# EAGLE design Blueberry Pi (EAGLE 7.3.0)
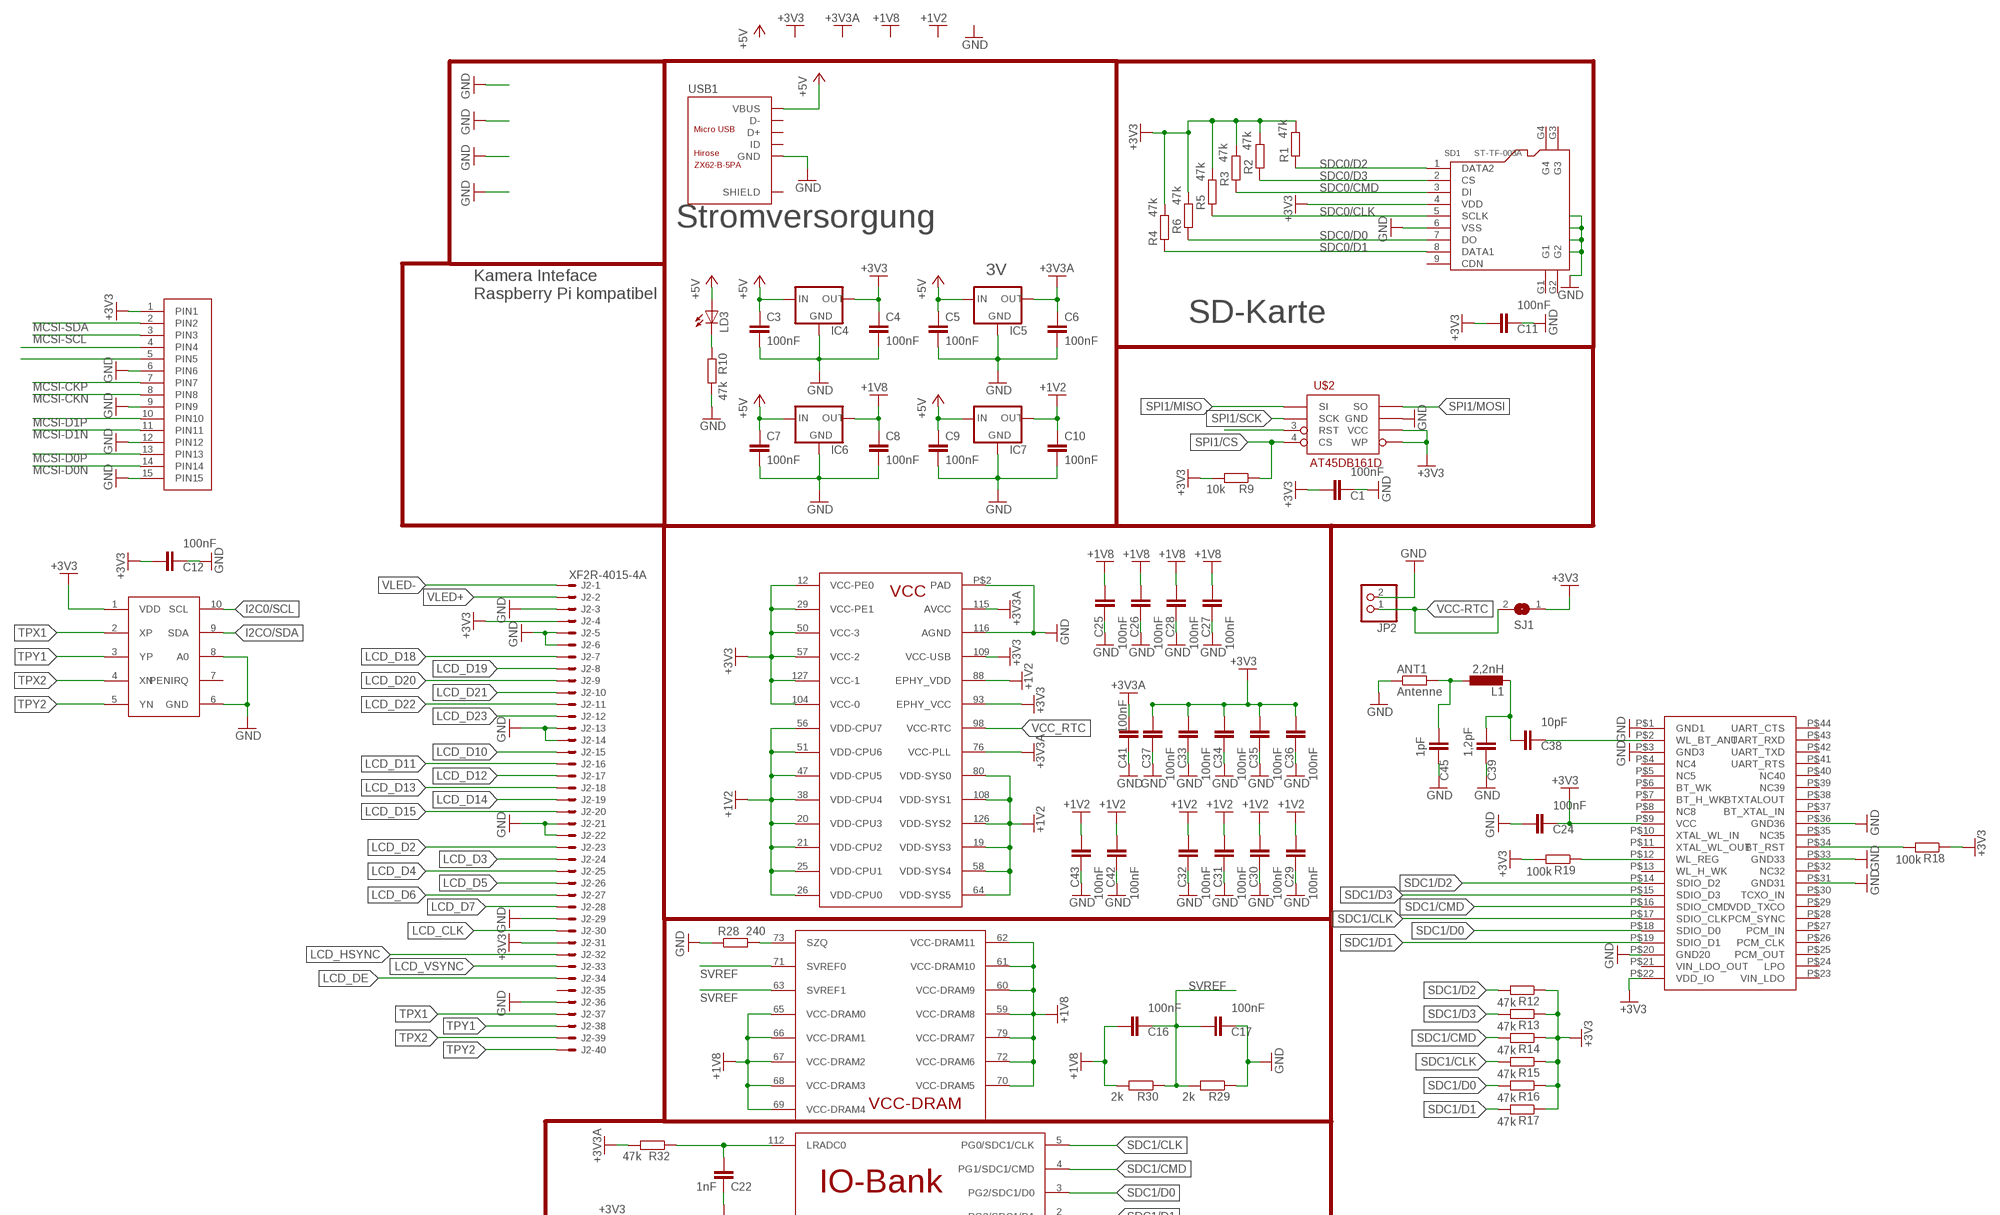
[diagram p0: schematic, sheet 1, part 1 of 2]
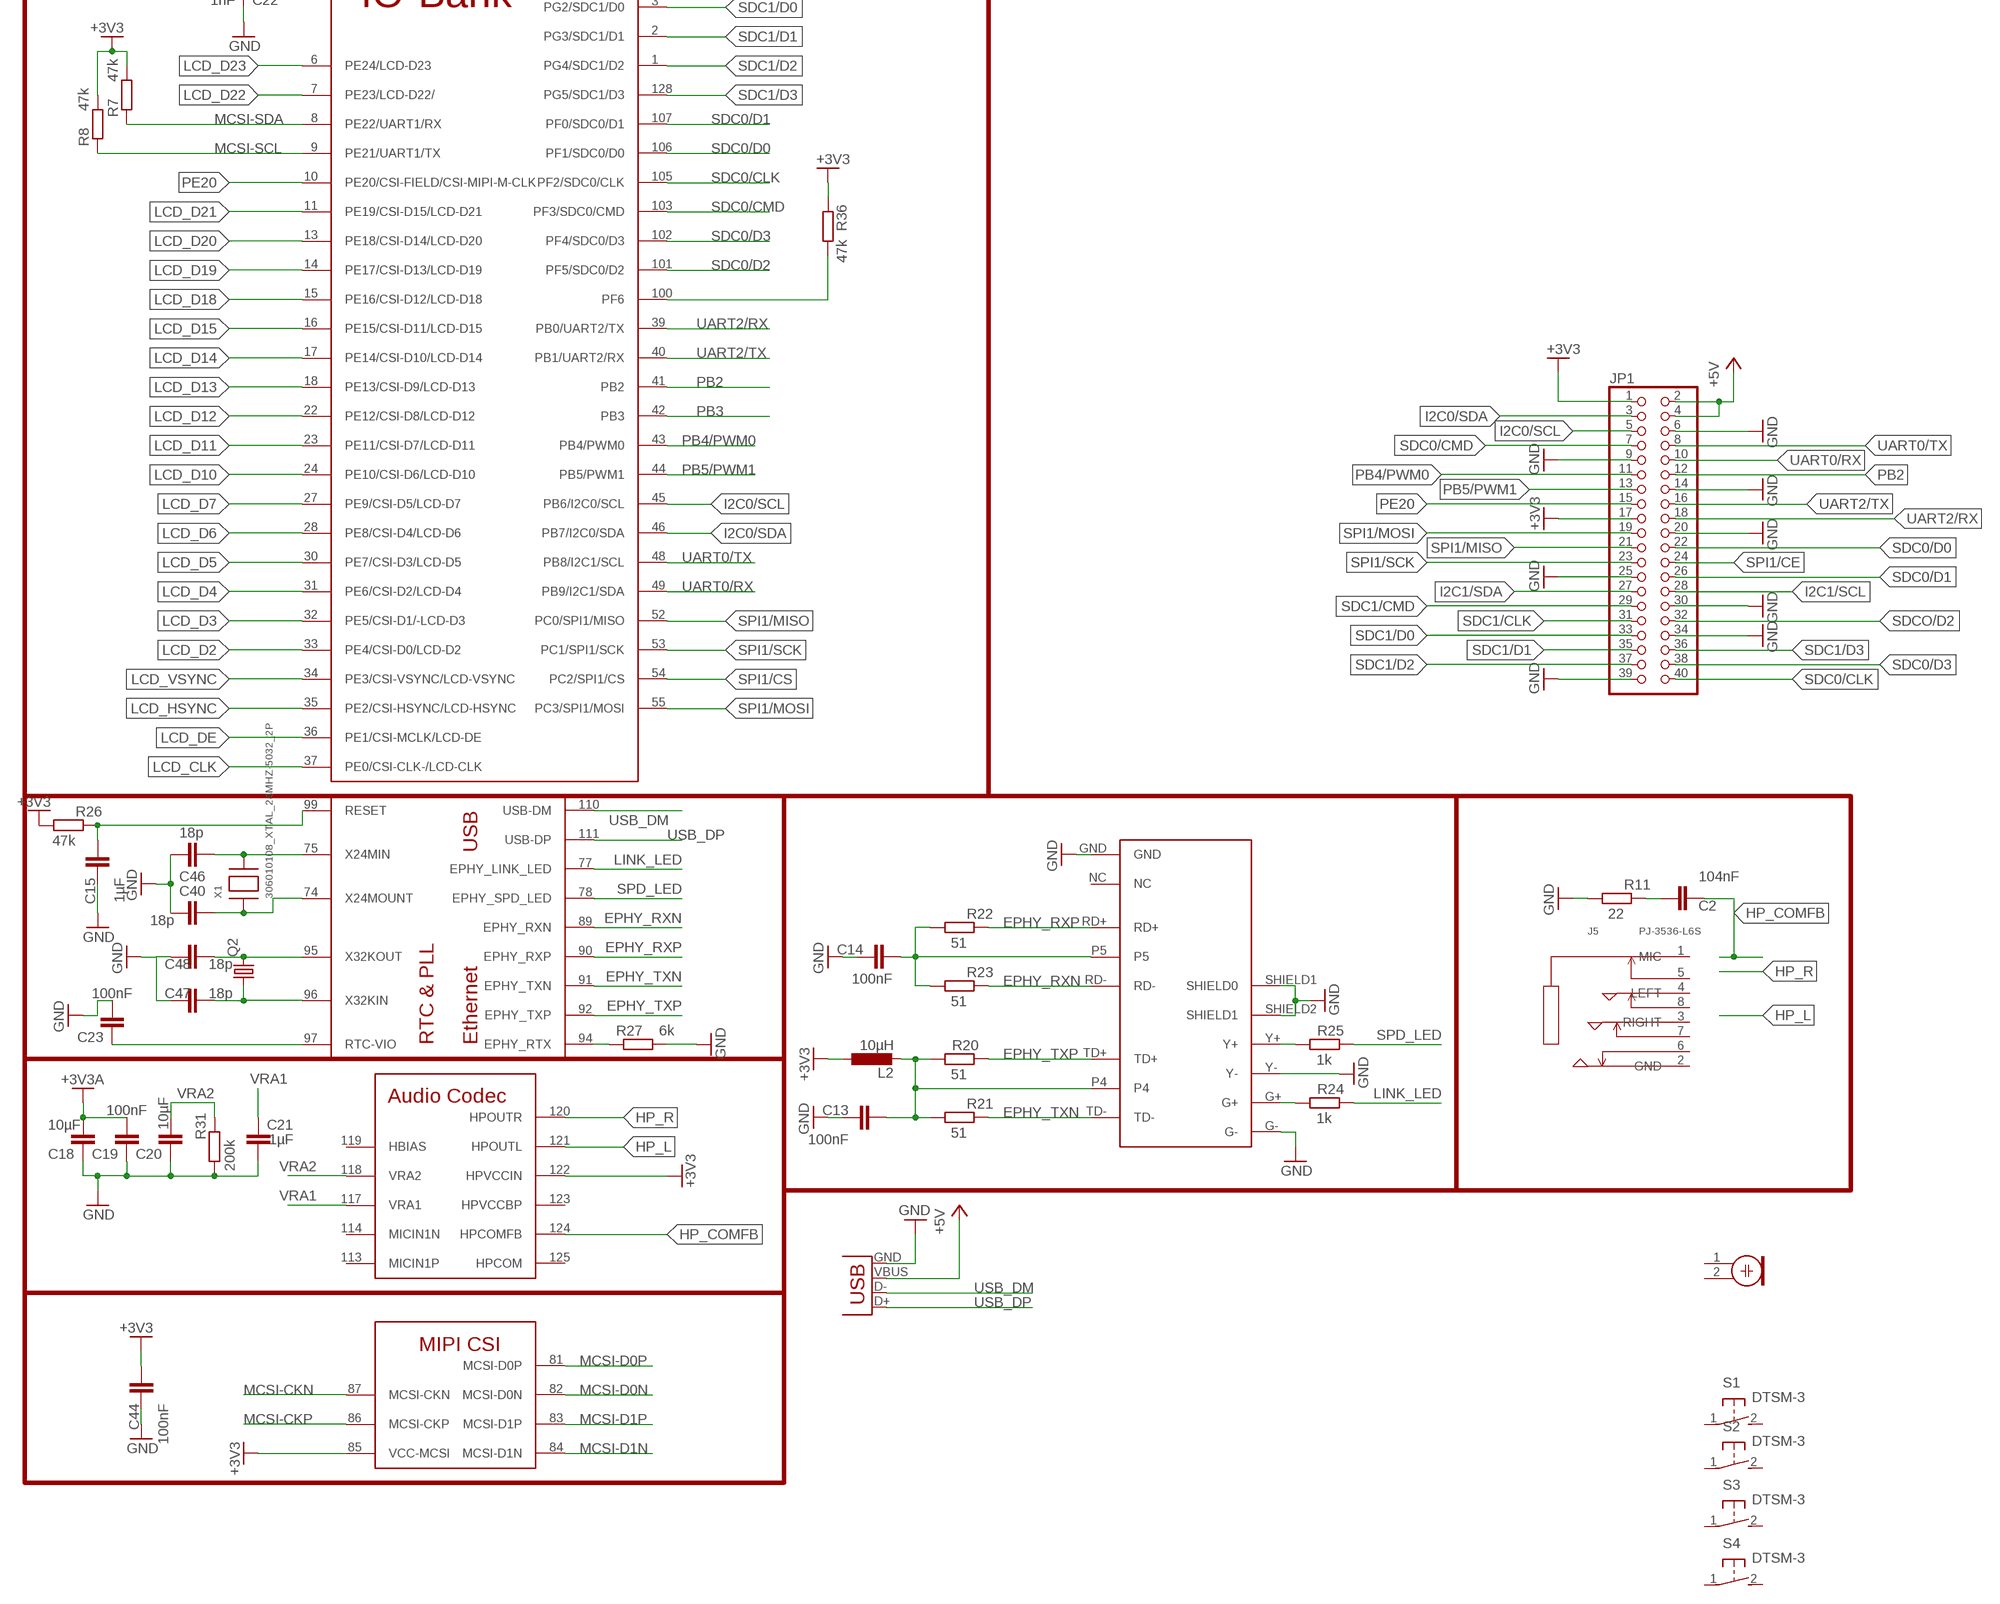
[diagram p1: schematic, sheet 1, part 2 of 2]

## Parts
ANT1  Antenne  R-EU_R0603  [R0603]
C1  100nF  C-EUC0603  [C0603]
C2  104nF  C-EUC0603  [C0603]
C3  100nF  C-EUC0603  [C0603]
C4  100nF  C-EUC0603  [C0603]
C5  100nF  C-EUC0603  [C0603]
C6  100nF  C-EUC0603  [C0603]
C7  100nF  C-EUC0603  [C0603]
C8  100nF  C-EUC0603  [C0603]
C9  100nF  C-EUC0603  [C0603]
C10  100nF  C-EUC0603  [C0603]
C11  100nF  C-EUC0603  [C0603]
C12  100nF  C-EUC0603  [C0603]
C13  100nF  C-EUC0603  [C0603]
C14  100nF  C-EUC0603  [C0603]
C15  1µF  C-EUC0603  [C0603]
C16  100nF  C-EUC0603  [C0603]
C17  100nF  C-EUC0603  [C0603]
C18  10µF  C-EUC0603  [C0603]
C19  100nF  C-EUC0603  [C0603]
C20  10µF  C-EUC0603  [C0603]
C21  1µF  C-EUC0603  [C0603]
C22  1nF  C-EUC0603  [C0603]
C23  100nF  C-EUC0603  [C0603]
C24  100nF  C-EUC0603  [C0603]
C25  100nF  C-EUC0603  [C0603]
C26  100nF  C-EUC0603  [C0603]
C27  100nF  C-EUC0603  [C0603]
C28  100nF  C-EUC0603  [C0603]
C29  100nF  C-EUC0603  [C0603]
C30  100nF  C-EUC0603  [C0603]
C31  100nF  C-EUC0603  [C0603]
C32  100nF  C-EUC0603  [C0603]
C33  100nF  C-EUC0603  [C0603]
C34  100nF  C-EUC0603  [C0603]
C35  100nF  C-EUC0603  [C0603]
C36  100nF  C-EUC0603  [C0603]
C37  100nF  C-EUC0603  [C0603]
C38  10pF  C-EUC0603  [C0603]
C39  1,2pF  C-EUC0603  [C0603]
C40  18p  C-EUC0603  [C0603]
C41  100nF  C-EUC0603  [C0603]
C42  100nF  C-EUC0603  [C0603]
C43  100nF  C-EUC0603  [C0603]
C44  100nF  C-EUC0603  [C0603]
C45  1pF  C-EUC0603  [C0603]
C46  18p  C-EUC0603  [C0603]
C47  18p  C-EUC0603  [C0603]
C48  18p  C-EUC0603  [C0603]
IC1  V3S  [QFP-128]
IC4  LM1117  [SOT223]
IC5  LM1117  [SOT223]
IC6  LM1117  [SOT223]
IC7  LM1117  [SOT223]
J2  XF2R-4015-4A  [XF2R-4015-4A]
J5  PJ-3536-L6S  AUDIO-JACK-SMD-8P(PJ-3536-L6S)  [AUDIO8P-SMD-3.5-14.5X6X5MM]
JP1  PINHD-2X20  [2X20]
JP2  PINHD-1X2  [1X02]
L1  2,2nH  L-EUL0805  [L0805]
L2  10µH  L-EUL0805  [L0805]
LD3  LEDSMT1206  [1206]
M1  ELECTRET_MICROPHON-F6035AP  [F6035AP]
Q2  CRYSTALTC26H  [TC26H]
R1  47k  R-EU_R0603  [R0603]
R2  47k  R-EU_R0603  [R0603]
R3  47k  R-EU_R0603  [R0603]
R4  47k  R-EU_R0603  [R0603]
R5  47k  R-EU_R0603  [R0603]
R6  47k  R-EU_R0603  [R0603]
R7  47k  R-EU_R0603  [R0603]
R8  47k  R-EU_R0603  [R0603]
R9  10k  R-EU_R0603  [R0603]
R10  47k  R-EU_R0603  [R0603]
R11  22  R-EU_R0603  [R0603]
R12  47k  R-EU_R0603  [R0603]
R13  47k  R-EU_R0603  [R0603]
R14  47k  R-EU_R0603  [R0603]
R15  47k  R-EU_R0603  [R0603]
R16  47k  R-EU_R0603  [R0603]
R17  47k  R-EU_R0603  [R0603]
R18  100k  R-EU_R0603  [R0603]
R19  100k  R-EU_R0603  [R0603]
R20  51  R-EU_R0603  [R0603]
R21  51  R-EU_R0603  [R0603]
R22  51  R-EU_R0603  [R0603]
R23  51  R-EU_R0603  [R0603]
R24  1k  R-EU_R0603  [R0603]
R25  1k  R-EU_R0603  [R0603]
R26  47k  R-EU_R0603  [R0603]
R27  6k  R-EU_R0603  [R0603]
R28  240  R-EU_R0603  [R0603]
R29  2k  R-EU_R0603  [R0603]
R30  2k  R-EU_R0603  [R0603]
R31  200k  R-EU_R0603  [R0603]
R32  47k  R-EU_R0603  [R0603]
R36  47k  R-EU_R0603  [R0603]
S1  DTSM-3  [DTSM-3]
S2  DTSM-3  [DTSM-3]
S3  DTSM-3  [DTSM-3]
S4  DTSM-3  [DTSM-3]
SD1  ST-TF-003A  MICRO-SD-CARD-SOCKET-9P(ST-TF-003A)  [MICRO-SD9+4P-SMD-16.1X14.5X1.85MM]
SJ1  SJ  [SJ]
U$1  NS2009  [MSOP10]
U$2  AT45DB161D  [SO08-EIAJ]
U$3  HR911105A  [RJ45]
U$4  RTL8723BS  [LGA]
U$5  52610-1533  [MOLEX_52610-1533]
USB1  ZX62-B-5PA  MICRO-USB-SMD(ZX62-B-5PA)  [MICRO-USB5+6P-SMD-0.65-AB]
X1  306010108_XTAL_24MHZ-5032_2P  [X5032_2P]
X2  USB-A-H  [USB-A-H]

## Nets
+1V2: C10.1 C29.1 C30.1 C31.1 C32.1 C42.1 C43.1 IC1.19(VDD-SYS3) IC1.20(VDD-CPU3) IC1.21(VDD-CPU2) IC1.25(VDD-CPU1) IC1.26(VDD-CPU0) IC1.38(VDD-CPU4) IC1.47(VDD-CPU5) IC1.51(VDD-CPU6) IC1.56(VDD-CPU7) IC1.58(VDD-SYS4) IC1.64(VDD-SYS5) IC1.80(VDD-SYS0) IC1.88(EPHY_VDD) IC1.108(VDD-SYS1) IC1.126(VDD-SYS2) IC7.2(OUT)
+1V8: C8.1 C16.1 C25.1 C26.1 C27.1 C28.1 IC1.59(VCC-DRAM8) IC1.60(VCC-DRAM9) IC1.61(VCC-DRAM10) IC1.62(VCC-DRAM11) IC1.65(VCC-DRAM0) IC1.66(VCC-DRAM1) IC1.67(VCC-DRAM2) IC1.68(VCC-DRAM3) IC1.69(VCC-DRAM4) IC1.70(VCC-DRAM5) IC1.72(VCC-DRAM6) IC1.79(VCC-DRAM7) IC6.2(OUT) R30.2
+3V3: C1.1 C4.1 C11.1 C12.1 C24.2 C33.1 C34.1 C35.1 C36.1 C37.1 C44.1 IC1.12(VCC-PE0) IC1.29(VCC-PE1) IC1.50(VCC-3) IC1.57(VCC-2) IC1.85(VCC-MCSI) IC1.93(EPHY_VCC) IC1.104(VCC-0) IC1.109(VCC-USB) IC1.122(HPVCCIN) IC1.127(VCC-1) IC4.2(OUT) J2.4 J2.31 JP1.1 JP1.17 L2.1 R1.2 R2.2 R3.2 R4.2 R5.2 R6.2 R7.2 R8.2 R9.2 R12.1 R13.1 R14.1 R15.1 R16.1 R17.1 R18.1 R19.2 R26.2 R36.1 SD1.4(VDD) SJ1.1 U$1.1(VDD) U$2.5(WP) U$2.6(VCC) U$4.P$9(VCC) U$4.P$22(VDD_IO) U$5.1(PIN1)
+3V3A: C6.1 C18.1 C19.1 C41.1 IC1.76(VCC-PLL) IC1.115(AVCC) IC5.2(OUT) R32.2
+5V: C3.1 C5.1 C7.1 C9.1 IC4.3(IN) IC5.3(IN) IC6.3(IN) IC7.3(IN) JP1.2 JP1.4 LD3.A X2.VBUS
EPHY_RXN: IC1.89(EPHY_RXN) R23.1 U$3.RD-
EPHY_RXP: IC1.90(EPHY_RXP) R22.1 U$3.RD+
EPHY_TXN: IC1.91(EPHY_TXN) R21.1 U$3.TD-
EPHY_TXP: IC1.92(EPHY_TXP) R20.1 U$3.TD+
GND: ANT1.1 C1.2 C3.2 C4.2 C5.2 C6.2 C7.2 C8.2 C9.2 C10.2 C11.2 C12.2 C13.2 C14.2 C15.2 C17.2 C18.2 C19.2 C20.2 C21.2 C22.1 C23.1 C24.1 C25.2 C26.2 C27.2 C28.2 C29.2 C30.2 C31.2 C32.2 C33.2 C34.2 C35.2 C36.2 C37.2 C39.1 C40.1 C41.2 C42.2 C43.2 C44.2 C45.1 C46.1 C47.1 C48.1 IC1.116(AGND) IC1.P$2(PAD) IC4.1(GND) IC5.1(GND) IC6.1(GND) IC7.1(GND) J2.3 J2.5 J2.6 J2.13 J2.14 J2.21 J2.22 J2.29 J2.36 JP1.6 JP1.9 JP1.14 JP1.20 JP1.25 JP1.30 JP1.34 JP1.39 JP2.2 R10.2 R11.2 R27.2 R28.1 R29.1 R31.2 SD1.6(VSS) U$1.6(GND) U$1.8(A0) U$2.7(GND) U$3.G- U$3.GND U$3.SHIELD1(SHIELD0) U$3.SHIELD2(SHIELD1) U$3.Y- U$4.P$1(GND1) U$4.P$3(GND3) U$4.P$20(GND20) U$4.P$31(GND31) U$4.P$33(GND33) U$4.P$36(GND36) U$5.6(PIN6) U$5.9(PIN9) U$5.12(PIN12) U$5.15(PIN15) USB1.5(GND) X2.GND
HP_COMFB: C2.2 IC1.124(HPCOMFB)
HP_L: IC1.121(HPOUTL)
HP_R: IC1.120(HPOUTR)
I2C0/SCL: IC1.45(PB6/I2C0/SCL) JP1.5 U$1.10(SCL)
I2C0/SDA: IC1.46(PB7/I2C0/SDA) JP1.3
I2C1/SCL: JP1.28
I2C1/SDA: JP1.27
I2CO/SDA: U$1.9(SDA)
LCD_CLK: IC1.37(PE0/CSI-CLK-/LCD-CLK) J2.30
LCD_D2: IC1.33(PE4/CSI-D0/LCD-D2) J2.23
LCD_D3: IC1.32(PE5/CSI-D1/-LCD-D3) J2.24
LCD_D4: IC1.31(PE6/CSI-D2/LCD-D4) J2.25
LCD_D5: IC1.30(PE7/CSI-D3/LCD-D5) J2.26
LCD_D6: IC1.28(PE8/CSI-D4/LCD-D6) J2.27
LCD_D7: IC1.27(PE9/CSI-D5/LCD-D7) J2.28
LCD_D10: IC1.24(PE10/CSI-D6/LCD-D10) J2.15
LCD_D11: IC1.23(PE11/CSI-D7/LCD-D11) J2.16
LCD_D12: IC1.22(PE12/CSI-D8/LCD-D12) J2.17
LCD_D13: IC1.18(PE13/CSI-D9/LCD-D13) J2.18
LCD_D14: IC1.17(PE14/CSI-D10/LCD-D14) J2.19
LCD_D15: IC1.16(PE15/CSI-D11/LCD-D15) J2.20
LCD_D18: IC1.15(PE16/CSI-D12/LCD-D18) J2.7
LCD_D19: IC1.14(PE17/CSI-D13/LCD-D19) J2.8
LCD_D20: IC1.13(PE18/CSI-D14/LCD-D20) J2.9
LCD_D21: IC1.11(PE19/CSI-D15/LCD-D21) J2.10
LCD_D22: IC1.7(PE23/LCD-D22/) J2.11
LCD_D23: IC1.6(PE24/LCD-D23) J2.12
LCD_DE: IC1.36(PE1/CSI-MCLK/LCD-DE) J2.34
LCD_HSYNC: IC1.35(PE2/CSI-HSYNC/LCD-HSYNC) J2.32
LCD_VSYNC: IC1.34(PE3/CSI-VSYNC/LCD-VSYNC) J2.33
LINK_LED: IC1.77(EPHY_LINK_LED) R24.1
MCSI-CKN: IC1.87(MCSI-CKN) U$5.8(PIN8)
MCSI-CKP: IC1.86(MCSI-CKP) U$5.7(PIN7)
MCSI-D0N: IC1.82(MCSI-D0N) U$5.14(PIN14)
MCSI-D0P: IC1.81(MCSI-D0P) U$5.13(PIN13)
MCSI-D1N: IC1.84(MCSI-D1N) U$5.11(PIN11)
MCSI-D1P: IC1.83(MCSI-D1P) U$5.10(PIN10)
MCSI-SCL: IC1.9(PE21/UART1/TX) R8.1 U$5.3(PIN3)
MCSI-SDA: IC1.8(PE22/UART1/RX) R7.1 U$5.2(PIN2)
N$2: R18.2 U$4.P$34(BT_RST)
N$3: C2.1 R11.1
N$4: C15.1 IC1.99(RESET) R26.1
N$5: U$2.3(RST)
N$6: LD3.C R10.1
N$7: R19.1 U$4.P$12(WL_REG)
N$8: U$5.5(PIN5)
N$9: U$5.4(PIN4)
N$10: C38.2 U$4.P$2(WL_BT_ANT)
N$11: C38.1 C39.2 L1.2
N$12: ANT1.2 C45.2 L1.1
N$17: IC1.94(EPHY_RTX) R27.1
N$18: R24.2 U$3.G+
N$19: IC1.73(SZQ) R28.2
N$20: R25.2 U$3.Y+
N$21: C13.1 L2.2 R20.2 R21.2 U$3.P4
N$22: C14.1 R22.2 R23.2 U$3.P5
N$23: C22.2 IC1.112(LRADC0) R32.1
N$24: C23.2 IC1.97(RTC-VIO)
N$25: IC1.100(PF6) R36.2
N$46: C40.2 IC1.74(X24MOUNT) X1.P$1
N$47: C46.2 IC1.75(X24MIN) X1.P$2
N$48: C47.2 IC1.96(X32KIN) Q2.1
N$49: C48.2 IC1.95(X32KOUT) Q2.2
PB2: IC1.41(PB2) JP1.12
PB3: IC1.42(PB3)
PB4/PWM0: IC1.43(PB4/PWM0) JP1.11
PB5/PWM1: IC1.44(PB5/PWM1) JP1.13
PE20: IC1.10(PE20/CSI-FIELD/CSI-MIPI-M-CLK) JP1.15
SDC0/CLK: IC1.105(PF2/SDC0/CLK) JP1.40 R5.1 SD1.5(SCLK)
SDC0/CMD: IC1.103(PF3/SDC0/CMD) JP1.7 R3.1 SD1.3(DI)
SDC0/D0: IC1.106(PF1/SDC0/D0) JP1.22 R6.1 SD1.7(DO)
SDC0/D1: IC1.107(PF0/SDC0/D1) JP1.26 R4.1 SD1.8(DATA1)
SDC0/D2: IC1.101(PF5/SDC0/D2) R1.1 SD1.1(DATA2)
SDC0/D3: IC1.102(PF4/SDC0/D3) JP1.38 R2.1 SD1.2(CS)
SDC1/CLK: IC1.5(PG0/SDC1/CLK) JP1.31 R15.2 U$4.P$17(SDIO_CLK)
SDC1/CMD: IC1.4(PG1/SDC1/CMD) JP1.29 R14.2 U$4.P$16(SDIO_CMD)
SDC1/D0: IC1.3(PG2/SDC1/D0) JP1.33 R16.2 U$4.P$18(SDIO_D0)
SDC1/D1: IC1.2(PG3/SDC1/D1) JP1.35 R17.2 U$4.P$19(SDIO_D1)
SDC1/D2: IC1.1(PG4/SDC1/D2) JP1.37 R12.2 U$4.P$14(SDIO_D2)
SDC1/D3: IC1.128(PG5/SDC1/D3) JP1.36 R13.2 U$4.P$15(SDIO_D3)
SDCO/D2: JP1.32
SPD_LED: IC1.78(EPHY_SPD_LED) R25.1
SPI1/CE: JP1.24
SPI1/CS: IC1.54(PC2/SPI1/CS) R9.1 U$2.4(CS)
SPI1/MISO: IC1.52(PC0/SPI1/MISO) JP1.21 U$2.1(SI)
SPI1/MOSI: IC1.55(PC3/SPI1/MOSI) JP1.19 U$2.8(SO)
SPI1/SCK: IC1.53(PC1/SPI1/SCK) JP1.23 U$2.2(SCK)
SVREF: C16.2 C17.1 IC1.63(SVREF1) IC1.71(SVREF0) R29.2 R30.1
TPX1: J2.37 U$1.2(XP)
TPX2: J2.39 U$1.4(XN)
TPY1: J2.38 U$1.3(YP)
TPY2: J2.40 U$1.5(YN)
UART0/RX: IC1.49(PB9/I2C1/SDA) JP1.10
UART0/TX: IC1.48(PB8/I2C1/SCL) JP1.8
UART2/RX: IC1.39(PB0/UART2/TX) JP1.18
UART2/TX: IC1.40(PB1/UART2/RX) JP1.16
USB_DM: IC1.110(USB-DM) X2.D-
USB_DP: IC1.111(USB-DP) X2.D+
VBUS: USB1.1(VBUS) ; supply symbol labelled +5V
VCC-RTC: JP2.1 SJ1.2
VCC_RTC: IC1.98(VCC-RTC)
VLED+: J2.2
VLED-: J2.1
VRA1: C21.1 IC1.117(VRA1)
VRA2: C20.1 IC1.118(VRA2) R31.1
Unconnected: IC1.113(MICIN1P) IC1.114(MICIN1N) IC1.119(HBIAS) IC1.123(HPVCCBP) IC1.125(HPCOM) J2.35 J5.1(MIC) J5.2(GND) J5.3(RIGHT) J5.4(LEFT) J5.5 J5.6 J5.7 J5.8 M1.1 M1.2 S1.1 S1.2 S2.1 S2.2 S3.1 S3.2 S4.1 S4.2 SD1.9(CDN) SD1.G1 SD1.G2 SD1.G3 SD1.G4 U$1.7(PENIRQ) U$3.NC U$4.P$4(NC4) U$4.P$5(NC5) U$4.P$6(BT_WK) U$4.P$7(BT_H_WK) U$4.P$8(NC8) U$4.P$10(XTAL_WL_IN) U$4.P$11(XTAL_WL_OUT) U$4.P$13(WL_H_WK) U$4.P$21(VIN_LDO_OUT) U$4.P$23(VIN_LDO) U$4.P$24(LPO) U$4.P$25(PCM_OUT) U$4.P$26(PCM_CLK) U$4.P$27(PCM_IN) U$4.P$28(PCM_SYNC) U$4.P$29(VDD_TXCO) U$4.P$30(TCXO_IN) U$4.P$32(NC32) U$4.P$35(NC35) U$4.P$37(BT_XTAL_IN) U$4.P$38(BTXTALOUT) U$4.P$39(NC39) U$4.P$40(NC40) U$4.P$41(UART_RTS) U$4.P$42(UART_TXD) U$4.P$43(UART_RXD) U$4.P$44(UART_CTS) USB1.2(D-) USB1.3(D+) USB1.4(ID) USB1.P1(SHIELD) USB1.P2(SHIELD) USB1.P3(SHIELD) USB1.P4(SHIELD) USB1.P5(SHIELD) USB1.P6(SHIELD)

## Notes on the sheet
- Stromversorgung
- 3V
- Kamera Inteface 
  Raspberry Pi kompatibel
- SD-Karte

## Library data of the parts
ANT1 R1-R32 R36 = rcl:R-EU_: RESISTOR, European symbol
C1-C48 = rcl:C-EU: CAPACITOR, European symbol
IC1 = Allwinner V3s:V3S
IC4-IC7 = v-reg-2:LM1117
J2 = con-omron:XF2*-40?: OMRON FPC Connector Source : http://www.omron.com/ecb/products/pdf/fpc.pdf
J5 = Seeed-Connector:AUDIO-JACK-SMD-8P(PJ-3536-L6S): 320040003; MPN: PJ-3536-L6S
JP1 = pinhead:PINHD-2X20: PIN HEADER
JP2 = pinhead:PINHD-1X2: PIN HEADER
L1 L2 = rcl:L-EU: INDUCTOR, European symbol
LD3 = led:LED: LED OSRAM: - CHIPLED LG R971, LG N971, LY N971, LG Q971, LY Q971, LO R971, LY R971 LH N974, LH R974 LS Q976, LO Q976, LY Q976 LO Q996 - Hyper CHIPLED LW Q18S LB Q993, LB Q99A, LB R99A - SideLED LS A670, LO A670, LY A670, LG A670, LP A670 LB A673, LV A673, LT A673, LW A673 LH A674 LY A675 LS A676, LA A676, LO A676, LY A676, LW A676 LS A679, LY A679, LG A679 - Hyper Micro SIDELED® LS Y876, LA Y876, LO Y876, LY Y876 LT Y87S - SmartLED LW L88C, LW L88S LB L89C, LB L89S, LG L890 LS L89K, LO L89K, LY L89K LS L896, LA L896, LO L896, LY L896 - TOPLED LS T670, LO T670, LY T670, LG T670, LP T670 LSG T670, LSP T670, LSY T670, LOP T670, LYG T670 LG T671, LOG T671, LSG T671 LB T673, LV T673, LT T673, LW T673 LH T674 LS T676, LA T676, LO T676, LY T676, LB T676, LH T676, LSB T676, LW T676 LB T67C, LV T67C, LT T67C, LS T67K, LO T67K, LY T67K, LW E67C LS E67B, LA E67B, LO E67B, LY E67B, LB E67C, LV E67C, LT E67C LW T67C LS T679, LY T679, LG T679 LS T770, LO T770, LY T770, LG T770, LP T770 LB T773, LV T773, LT T773, LW T773 LH T774 LS E675, LA E675, LY E675, LS T675 LS T776, LA T776, LO T776, LY T776, LB T776 LHGB T686 LT T68C, LB T68C - Hyper Mini TOPLED® LB M676 - Mini TOPLED Santana® LG M470 LS M47K, LO M47K, LY M47K Source: http://www.osram.convergy.de/
M1 = microphon:ELECTRET_MICROPHON-: Electret Condenser Microphone
Q2 = crystal:CRYSTAL: CRYSTAL; OC_FARNELL: unknown; OC_NEWARK: unknown
S1-S4 = switch-tact:DTSM-3
SD1 = Seeed-Connector:MICRO-SD-CARD-SOCKET-9P(ST-TF-003A): 320090000; MPN: ST-TF-003A
SJ1 = jumper:SJ: SMD solder JUMPER
U$1 = NS2009:NS2009
U$2 = SparkFun-Retired:AT45DB161D: 16-Mbit SPI flash memory Retired IC-08556
U$3 = HR911105A:HR911105A
U$4 = RTL8723BS_Modul:RTL8723BS
U$5 = Molex_By_element14_Batch_1:52610-1533
USB1 = Seeed-Connector:MICRO-USB-SMD(ZX62-B-5PA): 320010005; MPN: ZX62-B-5PA
X1 = Seeed-OPL-2017-01-Crystal-Akita:306010108_XTAL_24MHZ-5032_2P: TXC CORPORATION;7A-24.000MAAJ-T, SMD Crystal;24MHz-18pF-30ppm-2P-5*3.2*1.35, SKU: 306010108
X2 = con-usb:USB: USB Connectors

## Net classes
0 default: clearance 0.152 mm

## Board
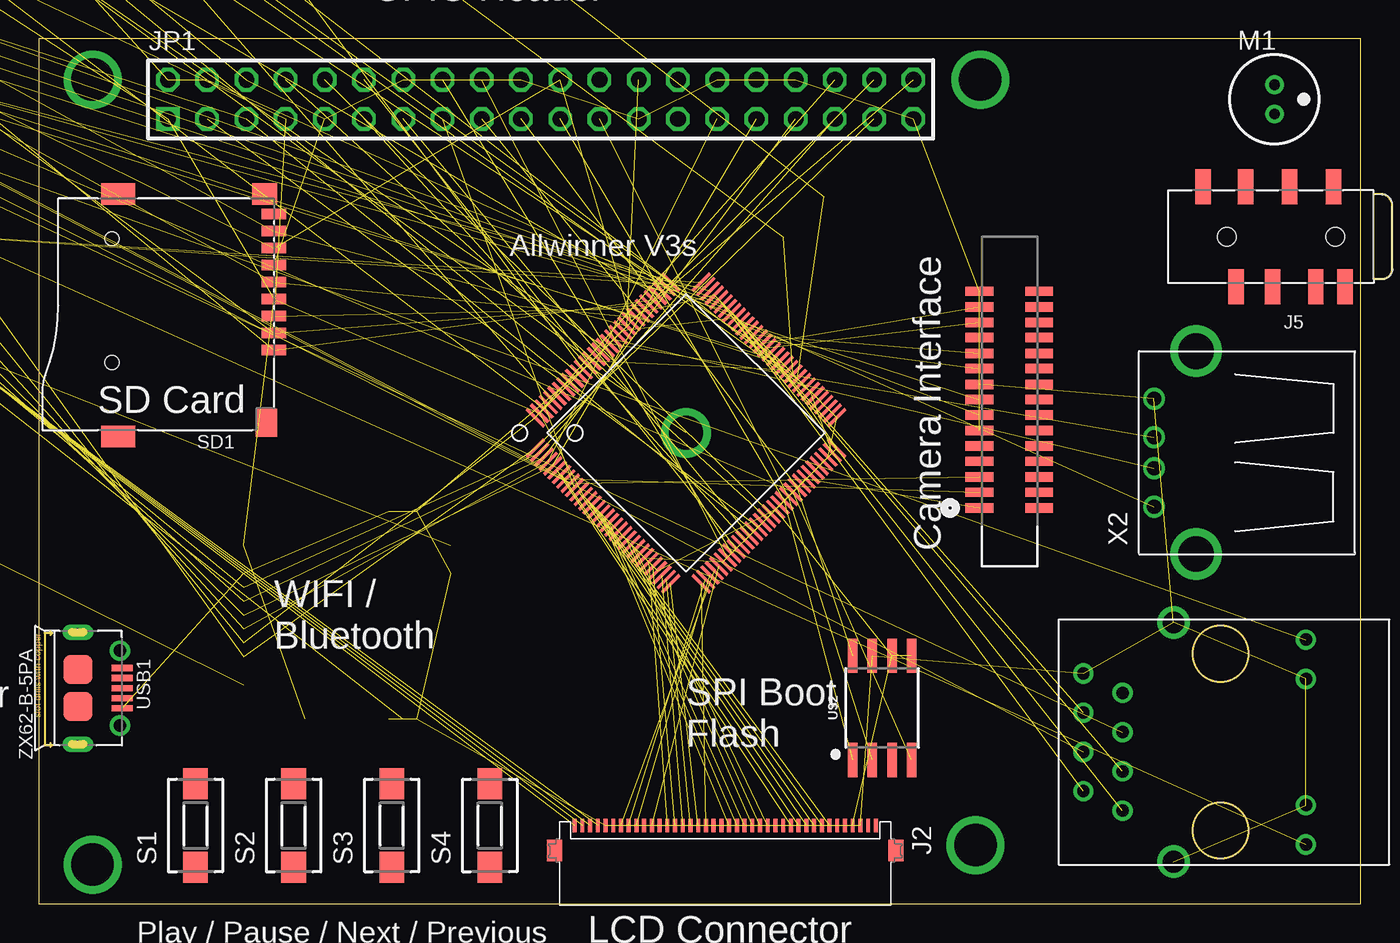
[diagram p2: board, top side]
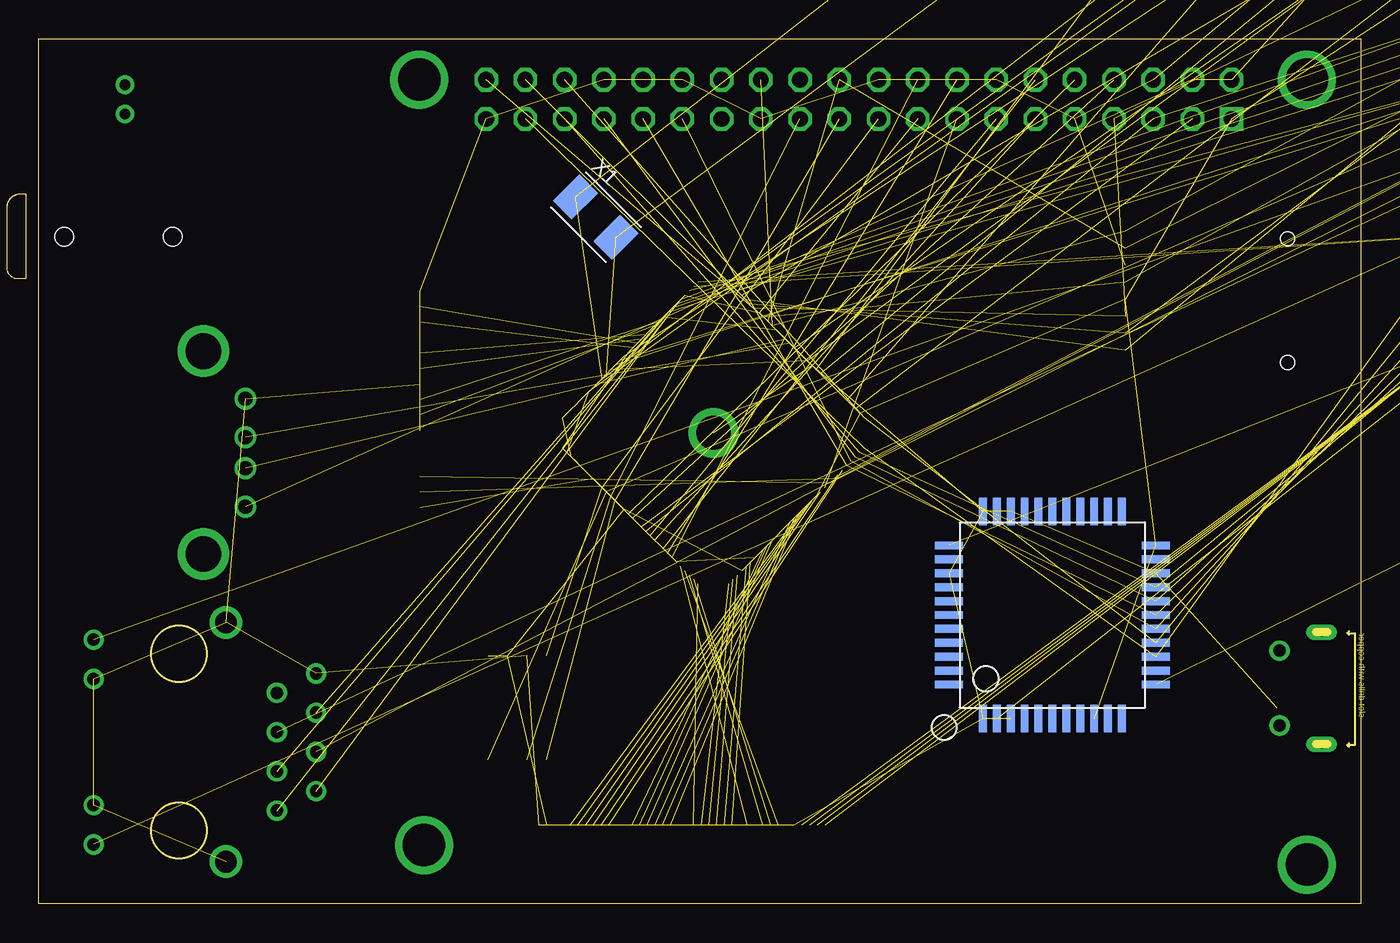
[diagram p3: board, bottom side, seen from below]

Size 85.6 x 56 mm. Coordinates in mm from the lower left corner, seen from the top.
Outline: 0,0 85.6,0 85.6,56 0,56 0,0
Copper layers (1*16): Top 0.035mm / dielectric 1.5mm / Bottom 0.035mm
Design rules "default": minimum track width 10mil, minimum drill 24mil, track to track 8mil, track to pad 8mil, pad to pad 8mil, via to via 8mil, smd to smd 8mil, copper to edge 40mil, drill to drill 8mil, minimum pad ring 10mil, minimum via ring 8mil, stop-mask expansion 4mil, vias tented up to drill 0mil, thermal gap 10mil

### Footprints (pad centres in the part's own frame; a part is rotated, then mirrored left to right if it is on the bottom)
R0603 = smd 1 x 1.1: 1 -0.85,0; 2 0.85,0
C0603 = smd 1.1 x 1: 1 -0.85,0; 2 0.85,0
QFP-128 = smd 0.2 x 1.6: 1 -6.2,-7.6; 2 -5.8,-7.6; 3 -5.4,-7.6; 4 -5,-7.6; 5 -4.6,-7.6; 6 -4.2,-7.6; 7 -3.8,-7.6; 8 -3.4,-7.6; 9 -3,-7.6; 10 -2.6,-7.6; 11 -2.2,-7.6; 12 -1.8,-7.6; 13 -1.4,-7.6; 14 -1,-7.6; 15 -0.6,-7.6; 16 -0.2,-7.6; 17 0.2,-7.6; 18 0.6,-7.6; 19 1,-7.6; 20 1.4,-7.6; 21 1.8,-7.6; 22 2.2,-7.6; 23 2.6,-7.6; 24 3,-7.6; 25 3.4,-7.6; 26 3.8,-7.6; 27 4.2,-7.6; 28 4.6,-7.6; 29 5,-7.6; 30 5.4,-7.6; 31 5.8,-7.6; 32 6.2,-7.6; 65 6.2,7.6; 66 5.8,7.6; 67 5.4,7.6; 68 5,7.6; 69 4.6,7.6; 70 4.2,7.6; 71 3.8,7.6; 72 3.4,7.6; 73 3,7.6; 74 2.6,7.6; 75 2.2,7.6; 76 1.8,7.6; 77 1.4,7.6; 78 1,7.6; 79 0.6,7.6; 80 0.2,7.6; 81 -0.2,7.6; 82 -0.6,7.6; 83 -1,7.6; 84 -1.4,7.6; 85 -1.8,7.6; 86 -2.2,7.6; 87 -2.6,7.6; 88 -3,7.6; 89 -3.4,7.6; 90 -3.8,7.6; 91 -4.2,7.6; 92 -4.6,7.6; 93 -5,7.6; 94 -5.4,7.6; 95 -5.8,7.6; 96 -6.2,7.6 | smd 1.6 x 0.2: 33 7.6,-6.2; 34 7.6,-5.8; 35 7.6,-5.4; 36 7.6,-5; 37 7.6,-4.6; 38 7.6,-4.2; 39 7.6,-3.8; 40 7.6,-3.4; 41 7.6,-3; 42 7.6,-2.6; 43 7.6,-2.2; 44 7.6,-1.8; 45 7.6,-1.4; 46 7.6,-1; 47 7.6,-0.6; 48 7.6,-0.2; 49 7.6,0.2; 50 7.6,0.6; 51 7.6,1; 52 7.6,1.4; 53 7.6,1.8; 54 7.6,2.2; 55 7.6,2.6; 56 7.6,3; 57 7.6,3.4; 58 7.6,3.8; 59 7.6,4.2; 60 7.6,4.6; 61 7.6,5; 62 7.6,5.4; 63 7.6,5.8; 64 7.6,6.2; 97 -7.6,6.2; 98 -7.6,5.8; 99 -7.6,5.4; 100 -7.6,5; 101 -7.6,4.6; 102 -7.6,4.2; 103 -7.6,3.8; 104 -7.6,3.4; 105 -7.6,3; 106 -7.6,2.6; 107 -7.6,2.2; 108 -7.6,1.8; 109 -7.6,1.4; 110 -7.6,1; 111 -7.6,0.6; 112 -7.6,0.2; 113 -7.6,-0.2; 114 -7.6,-0.6; 115 -7.6,-1; 116 -7.6,-1.4; 117 -7.6,-1.8; 118 -7.6,-2.2; 119 -7.6,-2.6; 120 -7.6,-3; 121 -7.6,-3.4; 122 -7.6,-3.8; 123 -7.6,-4.2; 124 -7.6,-4.6; 125 -7.6,-5; 126 -7.6,-5.4; 127 -7.6,-5.8; 128 -7.6,-6.2 | drill 2.2: P$2 0,0
SOT223 = smd 1.219 x 2.235: 1 -2.311,-3.099; 2 0,-3.099; 3 2.311,-3.099 | smd 3.6 x 2.2: 4 0,3.099
XF2R-4015-4A = smd 0.85 x 0.25: 1 -2.54,9.75; 2 -2.54,9.25; 3 -2.54,8.75; 4 -2.54,8.25; 5 -2.54,7.75; 6 -2.54,7.25; 7 -2.54,6.75; 8 -2.54,6.25; 9 -2.54,5.75; 10 -2.54,5.25; 11 -2.54,4.75; 12 -2.54,4.25; 13 -2.54,3.75; 14 -2.54,3.25; 15 -2.54,2.75; 16 -2.54,2.25; 17 -2.54,1.75; 18 -2.54,1.25; 19 -2.54,0.75; 20 -2.54,0.25; 21 -2.54,-0.25; 22 -2.54,-0.75; 23 -2.54,-1.25; 24 -2.54,-1.75; 25 -2.54,-2.25; 26 -2.54,-2.75; 27 -2.54,-3.25; 28 -2.54,-3.75; 29 -2.54,-4.25; 30 -2.54,-4.75; 31 -2.54,-5.25; 32 -2.54,-5.75; 33 -2.54,-6.25; 34 -2.54,-6.75; 35 -2.54,-7.25; 36 -2.54,-7.75; 37 -2.54,-8.25; 38 -2.54,-8.75; 39 -2.54,-9.25; 40 -2.54,-9.75 | smd 1.4 x 1: M1 -0.915,11.05; M2 -0.915,-11.05
AUDIO8P-SMD-3.5-14.5X6X5MM = smd 1 x 2.25: 1 3.05,3.24; 2 4.95,3.24; 3 7.75,3.24; 4 12.26,-3.24; 5 3.81,-3.24; 6 6.66,-3.24; 7 9.51,-3.24; 8 10.1,3.24 | hole 1.2: 3.7,0; 10.7,0
2X20 = drill 1.016 square: 1 -24.13,-1.27 | drill 1.016 octagon: 2 -24.13,1.27; 3 -21.59,-1.27; 4 -21.59,1.27; 5 -19.05,-1.27; 6 -19.05,1.27; 7 -16.51,-1.27; 8 -16.51,1.27; 9 -13.97,-1.27; 10 -13.97,1.27; 11 -11.43,-1.27; 12 -11.43,1.27; 13 -8.89,-1.27; 14 -8.89,1.27; 15 -6.35,-1.27; 16 -6.35,1.27; 17 -3.81,-1.27; 18 -3.81,1.27; 19 -1.27,-1.27; 20 -1.27,1.27; 21 1.27,-1.27; 22 1.27,1.27; 23 3.81,-1.27; 24 3.81,1.27; 25 6.35,-1.27; 26 6.35,1.27; 27 8.89,-1.27; 28 8.89,1.27; 29 11.43,-1.27; 30 11.43,1.27; 31 13.97,-1.27; 32 13.97,1.27; 33 16.51,-1.27; 34 16.51,1.27; 35 19.05,-1.27; 36 19.05,1.27; 37 21.59,-1.27; 38 21.59,1.27; 39 24.13,-1.27; 40 24.13,1.27
1X02 = drill 1.016 square: 1 -1.27,0 | drill 1.016 octagon: 2 1.27,0
L0805 = smd 1.3 x 1.5: 1 -0.95,0; 2 0.95,0
1206 = smd 1.6 x 1.803: A -1.422,0; C 1.422,0
F6035AP = drill 0.7 pad 1.2: 1 0,0.95; 2 0,-0.95
TC26H = drill 0.813: 1 -1.27,0; 2 1.27,0
DTSM-3 = smd 2 x 1.6: 1 -2.7,0; 2 2.7,0
MICRO-SD9+4P-SMD-16.1X14.5X1.85MM = smd 1.6 x 0.7: 1 0,2.25; 2 0,1.15; 3 0,0.05; 4 0,-1.05; 5 0,-2.15; 6 0,-3.25; 7 0,-4.35; 8 0,-5.45; 9 0,-6.55 | smd 1.6 x 1.4: G1 0.6,-7.85 | smd 2.2 x 1.4: G2 10.1,-7.85; G3 10.1,7.85 | smd 1.4 x 1.8: G4 0.5,6.95 | hole 0.9: 10.5,-4.95; 10.5,3.05
SJ = smd 1.168 x 1.6: 1 -0.762,0; 2 0.762,0
MSOP10 = smd 0.25 x 1: 1 -1,-2.113; 2 -0.5,-2.113; 3 0,-2.113; 4 0.5,-2.113; 5 1,-2.113; 6 1,2.113; 7 0.5,2.113; 8 0,2.113; 9 -0.5,2.113; 10 -1,2.113
SO08-EIAJ = smd 0.61 x 2.21: 1 -1.905,-3.378; 2 -0.635,-3.378; 3 0.635,-3.378; 4 1.905,-3.378; 5 1.905,3.353; 6 0.635,3.353; 7 -0.635,3.353; 8 -1.905,3.353
RJ45 = drill 0.8: G+ 5.84,-6.305; G- 5.84,-3.765; GND -8.57,4.76; NC -6.03,3.5; P4 -8.57,-0.32; P5 -6.03,0.96; RD+ -6.03,-1.58; RD- -8.57,2.22; TD+ -6.03,-4.12; TD- -8.57,-2.86; Y+ 5.84,6.945; Y- 5.84,4.405 | drill 1.4: SHIELD1 -2.73,-7.425; SHIELD2 -2.73,8.065
LGA = smd 1.8 x 0.51: P$1 -0.7,10.5; P$2 -0.7,9.6; P$3 -0.7,8.7; P$4 -0.7,7.8; P$5 -0.7,6.9; P$6 -0.7,6; P$7 -0.7,5.1; P$8 -0.7,4.2; P$9 -0.7,3.3; P$10 -0.7,2.4; P$11 -0.7,1.5; P$23 12.7,1.5; P$24 12.7,2.4; P$25 12.7,3.3; P$26 12.7,4.2; P$27 12.7,5.1; P$28 12.7,6; P$29 12.7,6.9; P$30 12.7,7.8; P$31 12.7,8.7; P$32 12.7,9.6; P$33 12.7,10.5 | smd 0.51 x 1.8: P$12 1.5,-0.7; P$13 2.4,-0.7; P$14 3.3,-0.7; P$15 4.2,-0.7; P$16 5.1,-0.7; P$17 6,-0.7; P$18 6.9,-0.7; P$19 7.8,-0.7; P$20 8.7,-0.7; P$21 9.6,-0.7; P$22 10.5,-0.7; P$34 10.5,12.7; P$35 9.6,12.7; P$36 8.7,12.7; P$37 7.8,12.7; P$38 6.9,12.7; P$39 6,12.7; P$40 5.1,12.7; P$41 4.2,12.7; P$42 3.3,12.7; P$43 2.4,12.7; P$44 1.5,12.7
MOLEX_52610-1533 = smd 0.61 x 1.803: 1 -7.391,2.591; 2 -6.375,2.591; 3 -5.385,2.591; 4 -4.369,2.591; 5 -3.378,2.591; 6 -2.388,2.591; 7 -1.372,2.591; 8 -0.381,2.591; 9 0.61,2.591; 10 1.626,2.591; 11 2.616,2.591; 12 3.632,2.591; 13 4.623,2.591; 14 5.613,2.591; 15 6.629,2.591; 200 -7.391,-1.27; 400 -6.375,-1.27; 600 -5.385,-1.27; 800 -4.369,-1.27; 1000 -3.378,-1.27; 1200 -2.388,-1.27; 1400 -1.372,-1.27; 1600 -0.381,-1.27; 1800 0.61,-1.27; 2000 1.626,-1.27; 2200 2.616,-1.27; 2400 3.632,-1.27; 2600 4.623,-1.27; 2800 5.613,-1.27; 3000 6.629,-1.27
MICRO-USB5+6P-SMD-0.65-AB = smd 0.4 x 1.35: 1 -1.3,2.875; 2 -0.65,2.875; 3 0,2.875; 4 0.65,2.875; 5 1.3,2.875 | smd 1.9 x 1.9: P1 -1.2,0; P2 1.2,0 | drill 0.508 pad 1.016 long: P3 -3.625,0; P4 3.625,0 | drill 0.8: P5 -2.425,2.73; P6 2.425,2.73
X5032_2P = smd 1.7 x 2.4: P$1 -1.85,0; P$2 1.85,0
USB-A-H = drill 0.914: D+ 2.718,-1.003; D- 2.718,1.003; GND 2.718,-3.493; VBUS 2.718,3.493 | drill 2.311: P$5 0,-6.566; P$6 0,6.566

### Placement (x,y rotation side)
ANT1  -69.85,68.58 0 top  (outside the outline)
C1  -97.79,83.82 0 top  (outside the outline)
C2  -17.78,90.17 0 top  (outside the outline)
C3  -24.13,90.17 0 top  (outside the outline)
C4  -30.48,90.17 0 top  (outside the outline)
C5  -36.83,90.17 0 top  (outside the outline)
C6  -43.18,90.17 0 top  (outside the outline)
C7  -49.53,90.17 0 top  (outside the outline)
C8  -55.88,90.17 0 top  (outside the outline)
C9  -62.23,90.17 0 top  (outside the outline)
C10  -68.58,90.17 0 top  (outside the outline)
C11  -74.93,90.17 0 top  (outside the outline)
C12  -81.28,90.17 0 top  (outside the outline)
C13  -87.63,90.17 0 top  (outside the outline)
C14  -93.98,90.17 0 top  (outside the outline)
C15  -95.25,100.33 0 top  (outside the outline)
C16  -17.78,95.25 0 top  (outside the outline)
C17  -24.13,95.25 0 top  (outside the outline)
C18  -80.01,100.33 0 top  (outside the outline)
C19  -30.48,95.25 0 top  (outside the outline)
C20  -85.09,100.33 0 top  (outside the outline)
C21  -16.51,105.41 0 top  (outside the outline)
C22  -21.59,105.41 0 top  (outside the outline)
C23  -36.83,95.25 0 top  (outside the outline)
C24  -43.18,95.25 0 top  (outside the outline)
C25  -49.53,95.25 0 top  (outside the outline)
C26  -55.88,95.25 0 top  (outside the outline)
C27  -62.23,95.25 0 top  (outside the outline)
C28  -68.58,95.25 0 top  (outside the outline)
C29  -74.93,95.25 0 top  (outside the outline)
C30  -81.28,95.25 0 top  (outside the outline)
C31  -87.63,95.25 0 top  (outside the outline)
C32  -93.98,95.25 0 top  (outside the outline)
C33  -17.78,100.33 0 top  (outside the outline)
C34  -24.13,100.33 0 top  (outside the outline)
C35  -30.48,100.33 0 top  (outside the outline)
C36  -36.83,100.33 0 top  (outside the outline)
C37  -43.18,100.33 0 top  (outside the outline)
C38  -90.17,100.33 0 top  (outside the outline)
C39  -74.93,100.33 0 top  (outside the outline)
C40  -26.67,105.41 0 top  (outside the outline)
C41  -49.53,100.33 0 top  (outside the outline)
C42  -55.88,100.33 0 top  (outside the outline)
C43  -62.23,100.33 0 top  (outside the outline)
C44  -68.58,100.33 0 top  (outside the outline)
C45  -31.75,105.41 0 top  (outside the outline)
C46  -36.83,105.41 0 top  (outside the outline)
C47  -41.91,105.41 0 top  (outside the outline)
C48  -46.99,105.41 0 top  (outside the outline)
IC1  41.91,30.48 315 top
IC4  -59.69,49.53 0 top  (outside the outline)
IC5  -67.31,49.53 0 top  (outside the outline)
IC6  -74.93,49.53 0 top  (outside the outline)
IC7  -82.55,49.53 0 top  (outside the outline)
J2  44.45,2.54 270 top
J5  87.63,43.18 180 top
JP1  32.5,52.07 0 top
JP2  -52.07,105.41 0 top  (outside the outline)
L1  -76.2,68.58 0 top  (outside the outline)
L2  -82.55,68.58 0 top  (outside the outline)
LD3  -58.42,104.14 0 top  (outside the outline)
M1  80.01,52.07 0 top
Q2  -44.45,45.72 0 top  (outside the outline)
R1  -41.91,83.82 0 top  (outside the outline)
R2  -46.99,83.82 0 top  (outside the outline)
R3  -52.07,83.82 0 top  (outside the outline)
R4  -57.15,83.82 0 top  (outside the outline)
R5  -62.23,83.82 0 top  (outside the outline)
R6  -67.31,83.82 0 top  (outside the outline)
R7  -72.39,83.82 0 top  (outside the outline)
R8  -77.47,83.82 0 top  (outside the outline)
R9  -82.55,83.82 0 top  (outside the outline)
R10  -21.59,77.47 0 top  (outside the outline)
R11  -26.67,77.47 0 top  (outside the outline)
R12  -31.75,77.47 0 top  (outside the outline)
R13  -36.83,77.47 0 top  (outside the outline)
R14  -41.91,77.47 0 top  (outside the outline)
R15  -46.99,77.47 0 top  (outside the outline)
R16  -52.07,77.47 0 top  (outside the outline)
R17  -57.15,77.47 0 top  (outside the outline)
R18  -88.9,68.58 0 top  (outside the outline)
R19  -95.25,68.58 0 top  (outside the outline)
R20  -62.23,77.47 0 top  (outside the outline)
R21  -67.31,77.47 0 top  (outside the outline)
R22  -72.39,77.47 0 top  (outside the outline)
R23  -77.47,77.47 0 top  (outside the outline)
R24  -82.55,77.47 0 top  (outside the outline)
R25  -87.63,77.47 0 top  (outside the outline)
R26  -92.71,77.47 0 top  (outside the outline)
R27  -97.79,77.47 0 top  (outside the outline)
R28  -16.51,83.82 0 top  (outside the outline)
R29  -21.59,83.82 0 top  (outside the outline)
R30  -26.67,83.82 0 top  (outside the outline)
R31  -16.51,77.47 0 top  (outside the outline)
R32  -31.75,83.82 0 top  (outside the outline)
R36  -36.83,83.82 0 top  (outside the outline)
S1  10.16,5.08 90 top
S2  16.51,5.08 90 top
S3  22.86,5.08 90 top
S4  29.21,5.08 90 top
SD1  15.24,38.1 180 top
SJ1  -63.5,104.14 0 top  (outside the outline)
U$1  -46.99,68.58 0 top  (outside the outline)
U$2  54.61,12.7 0 top
U$3  76.2,10.16 0 top
U$4  13.97,12.7 90 bottom
U$5  63.5,33.02 90 top
USB1  2.54,13.97 270 top
X1  49.53,44.45 315 bottom
X2  74.93,29.21 180 top

### Tracks (layer width: path | path; a pad name or v marks a point on that pad's centre or on a via)
+1V2  (22 unrouted)
+1V8  (19 unrouted)
+3V3  (53 unrouted)
+3V3A  (7 unrouted)
+5V  (11 unrouted)
EPHY_RXN  (2 unrouted)
EPHY_RXP  (2 unrouted)
EPHY_TXN  (2 unrouted)
EPHY_TXP  (2 unrouted)
GND  (96 unrouted)
HP_COMFB  (1 unrouted)
I2C0/SCL  (2 unrouted)
I2C0/SDA  (1 unrouted)
LCD_CLK  (1 unrouted)
LCD_D2  (1 unrouted)
LCD_D3  (1 unrouted)
LCD_D4  (1 unrouted)
LCD_D5  (1 unrouted)
LCD_D6  (1 unrouted)
LCD_D7  (1 unrouted)
LCD_D10  (1 unrouted)
LCD_D11  (1 unrouted)
LCD_D12  (1 unrouted)
LCD_D13  (1 unrouted)
LCD_D14  (1 unrouted)
LCD_D15  (1 unrouted)
LCD_D18  (1 unrouted)
LCD_D19  (1 unrouted)
LCD_D20  (1 unrouted)
LCD_D21  (1 unrouted)
LCD_D22  (1 unrouted)
LCD_D23  (1 unrouted)
LCD_DE  (1 unrouted)
LCD_HSYNC  (1 unrouted)
LCD_VSYNC  (1 unrouted)
LINK_LED  (1 unrouted)
MCSI-CKN  (1 unrouted)
MCSI-CKP  (1 unrouted)
MCSI-D0N  (1 unrouted)
MCSI-D0P  (1 unrouted)
MCSI-D1N  (1 unrouted)
MCSI-D1P  (1 unrouted)
MCSI-SCL  (2 unrouted)
MCSI-SDA  (2 unrouted)
N$1  (via drill 2.75)
  other vias: 3.5,53.34 3.5,2.54 60.65,3.81
N$2  (1 unrouted)
N$3  (1 unrouted)
N$4  (2 unrouted)
N$6  (1 unrouted)
N$7  (1 unrouted)
N$10  (1 unrouted)
N$11  (2 unrouted)
N$12  (2 unrouted)
N$13  (via drill 2.75)
  other vias: 60.96,53.34
N$17  (1 unrouted)
N$18  (1 unrouted)
N$19  (1 unrouted)
N$20  (1 unrouted)
N$21  (4 unrouted)
N$22  (3 unrouted)
N$23  (2 unrouted)
N$24  (1 unrouted)
N$25  (1 unrouted)
N$46  (2 unrouted)
N$47  (2 unrouted)
N$48  (2 unrouted)
N$49  (2 unrouted)
PB2  (1 unrouted)
PB4/PWM0  (1 unrouted)
PB5/PWM1  (1 unrouted)
PE20  (1 unrouted)
SDC0/CLK  (3 unrouted)
SDC0/CMD  (3 unrouted)
SDC0/D0  (3 unrouted)
SDC0/D1  (3 unrouted)
SDC0/D2  (2 unrouted)
SDC0/D3  (3 unrouted)
SDC1/CLK  (3 unrouted)
SDC1/CMD  (3 unrouted)
SDC1/D0  (3 unrouted)
SDC1/D1  (3 unrouted)
SDC1/D2  (3 unrouted)
SDC1/D3  (3 unrouted)
SPD_LED  (1 unrouted)
SPI1/CS  (2 unrouted)
SPI1/MISO  (2 unrouted)
SPI1/MOSI  (2 unrouted)
SPI1/SCK  (2 unrouted)
SVREF  (5 unrouted)
TPX1  (1 unrouted)
TPX2  (1 unrouted)
TPY1  (1 unrouted)
TPY2  (1 unrouted)
UART0/RX  (1 unrouted)
UART0/TX  (1 unrouted)
UART2/RX  (1 unrouted)
UART2/TX  (1 unrouted)
USB_DM  (1 unrouted)
USB_DP  (1 unrouted)
VCC-RTC  (1 unrouted)
VRA1  (1 unrouted)
VRA2  (2 unrouted)

### Text on the board
tNames: GPIO Header | Microphone | Allwinner V3s | Audio Jack | SD Card | USB Host | Camera Interface | WIFI / / Bluetooth | Power | SPI Boot / Flash | Ethernet | Play / Pause / Next / Previous | LCD Connector